# Altium schematic sheet STM32F103传感器板.SchDoc
size A3
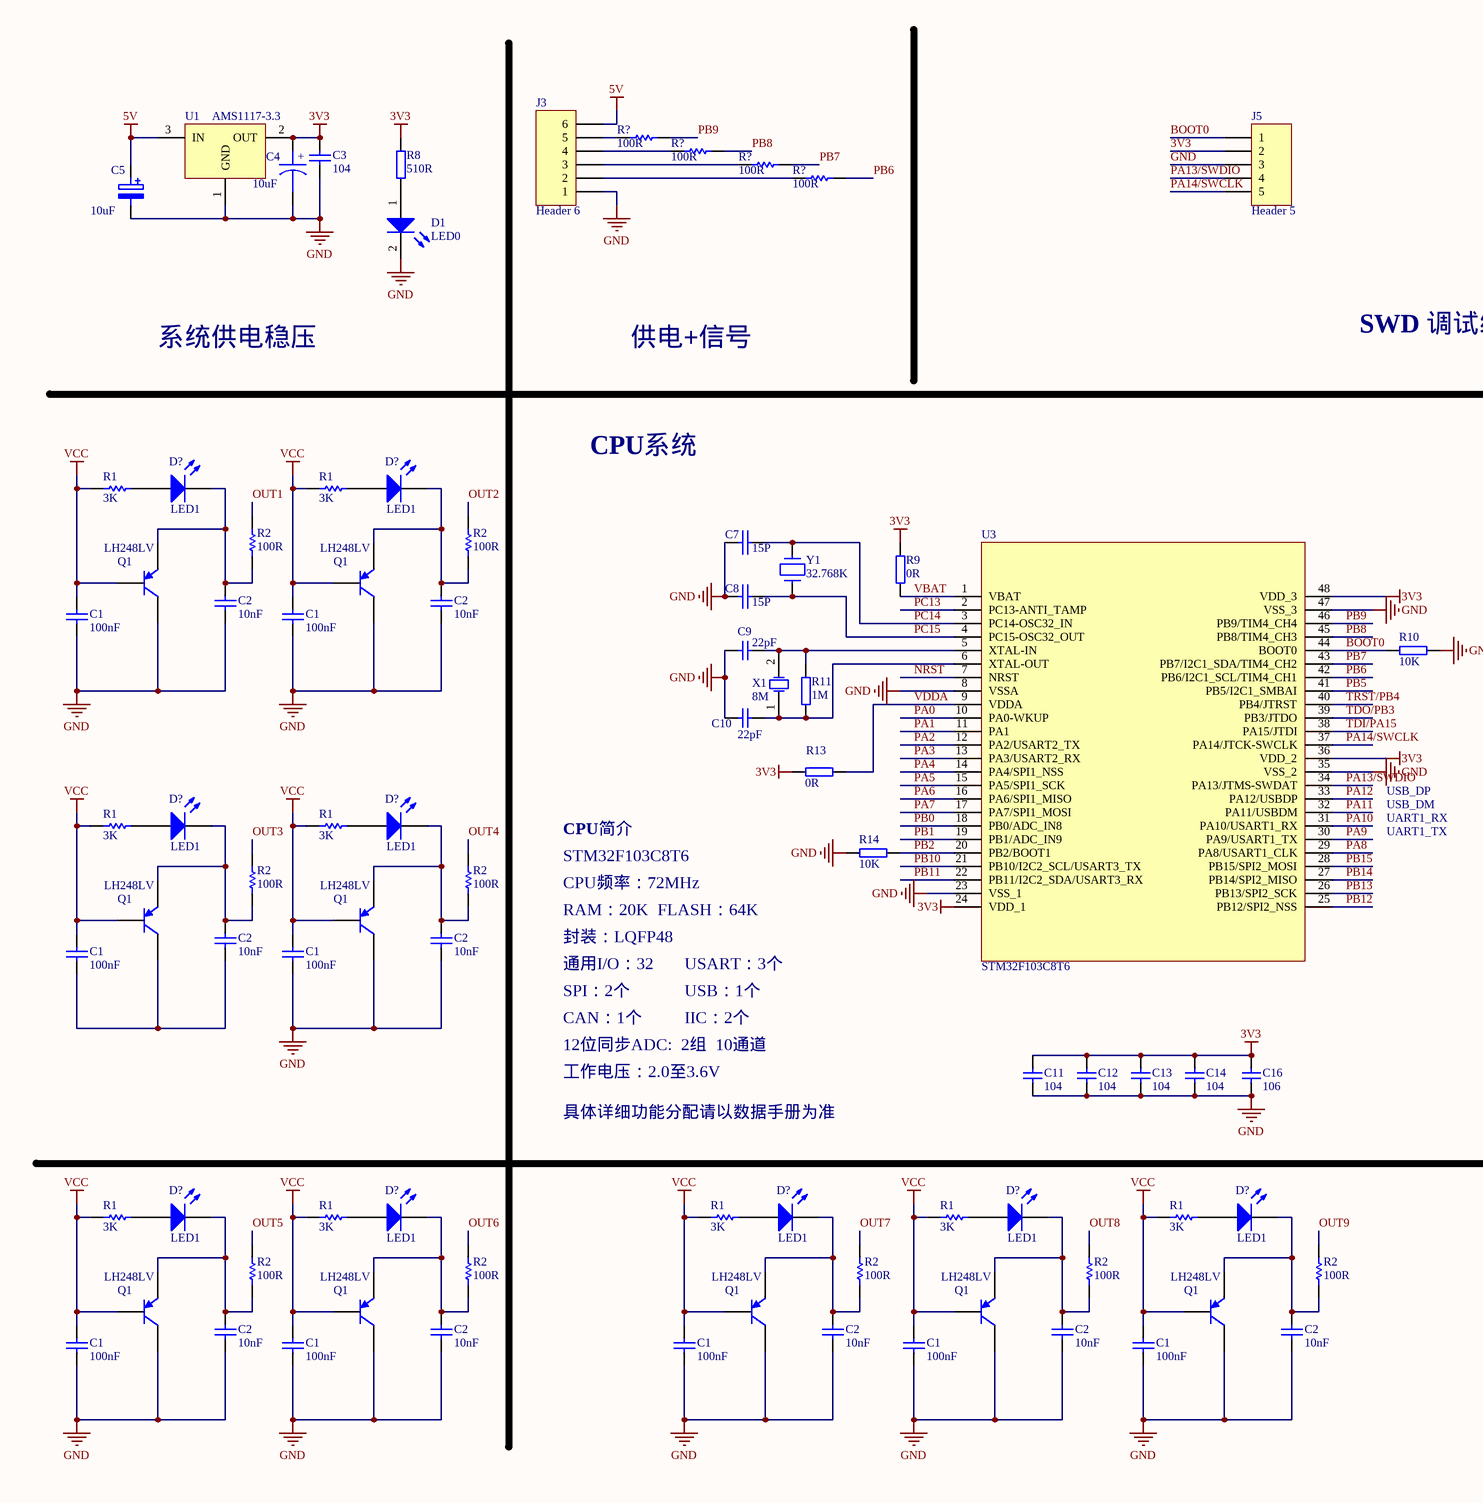
[diagram p0: STM32F103传感器板.SchDoc, left]
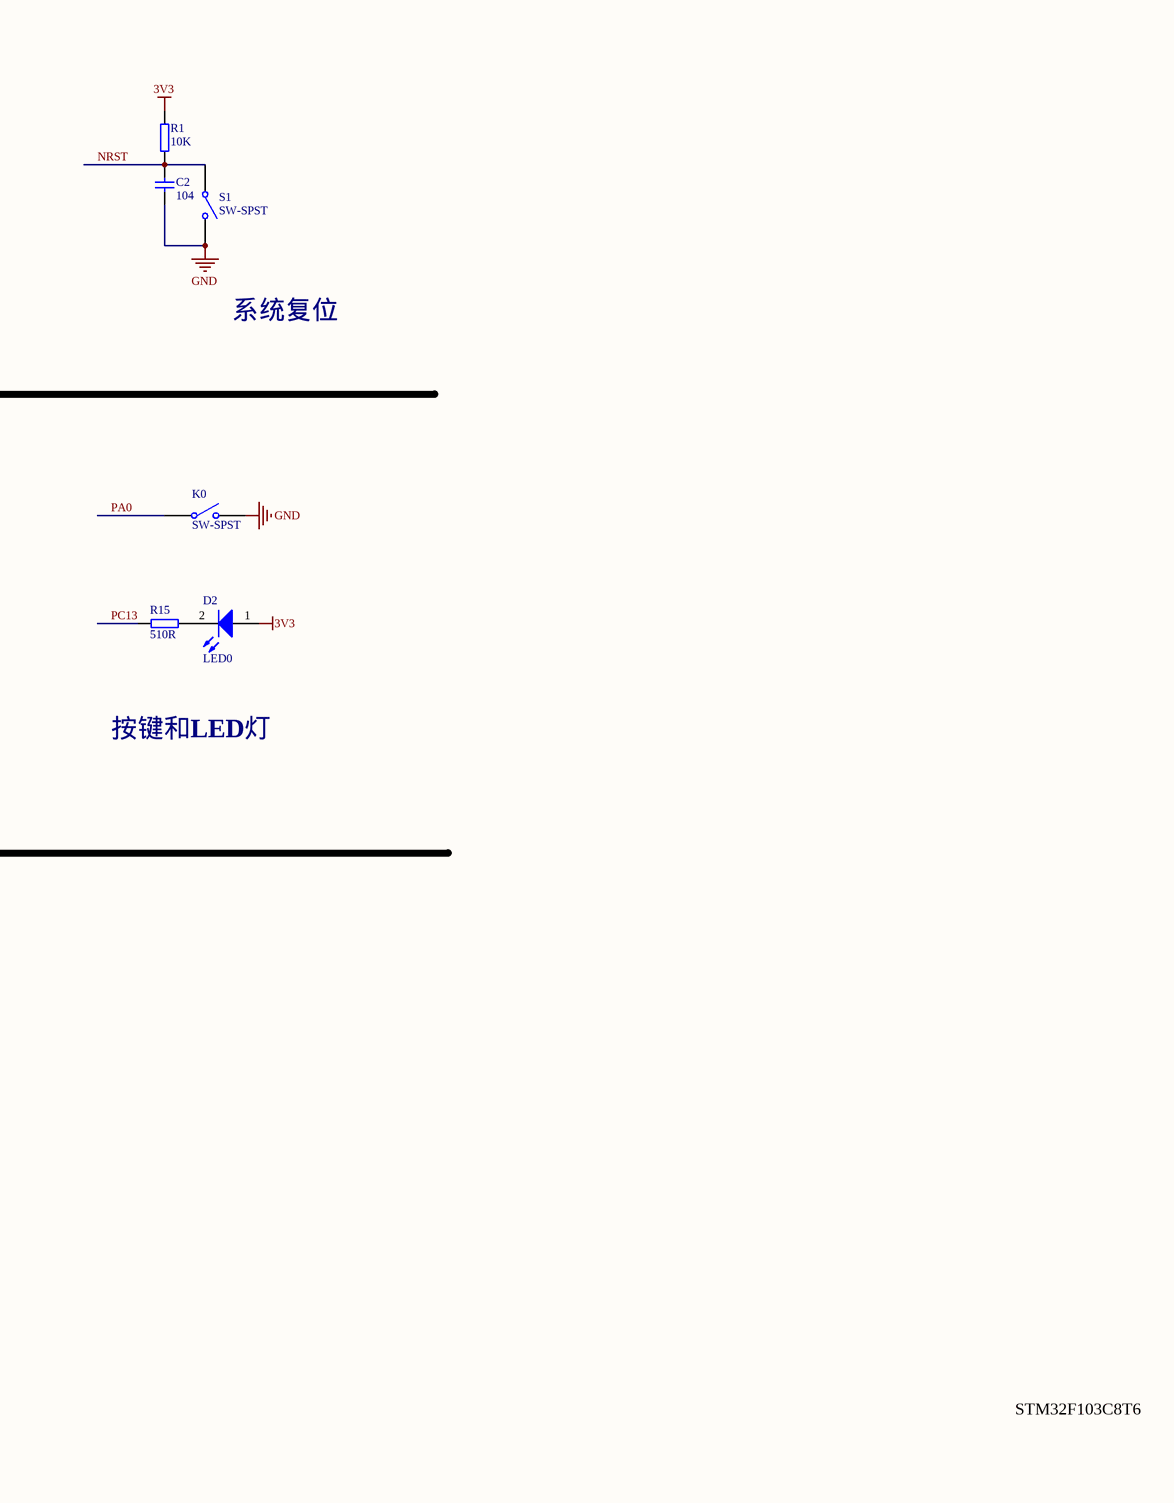
[diagram p1: STM32F103传感器板.SchDoc, right]

## Parts
(Parts that share a designator on the sheet are numbered #1, #2 ... from top to bottom, then left to right.)
C1#1  100nF  [RAD-0.3]
C1#2  100nF  [RAD-0.3]
C1#3  100nF  [RAD-0.3]
C1#4  100nF  [RAD-0.3]
C1#5  100nF  [RAD-0.3]
C1#6  100nF  [RAD-0.3]
C1#7  100nF  [RAD-0.3]
C1#8  100nF  [RAD-0.3]
C1#9  100nF  [RAD-0.3]
C2#1  104  [RC0603]
C2#2  10nF  [RAD-0.3]
C2#3  10nF  [RAD-0.3]
C2#4  10nF  [RAD-0.3]
C2#5  10nF  [RAD-0.3]
C2#6  10nF  [RAD-0.3]
C2#7  10nF  [RAD-0.3]
C2#8  10nF  [RAD-0.3]
C2#9  10nF  [RAD-0.3]
C2#10  10nF  [RAD-0.3]
C3  104  [RC0603]
C4  10uF  [RC0805]
C5  10uF  [RC0805]
C7  15P  [RC0603]
C8  15P  [RC0603]
C9  22pF  [RC0603]
C10  22pF  [RC0603]
C11  104  [RC0603]
C12  104  [RC0603]
C13  104  [RC0603]
C14  104  [RC0603]
C16  106  [RC0805]
D1  LED0  [LED0805]
D2  LED0  [LED0805]
D?#1  LED1  [LED-1]
D?#2  LED1  [LED-1]
D?#3  LED1  [LED-1]
D?#4  LED1  [LED-1]
D?#5  LED1  [LED-1]
D?#6  LED1  [LED-1]
D?#7  LED1  [LED-1]
D?#8  LED1  [LED-1]
D?#9  LED1  [LED-1]
J3  Header 6  [HDR1X6]
J5  Header 5  [HDR1X5]
K0  SW-SPST  [SMT-KEY]
Q1#1  LH248LV  [TO-92A]
Q1#2  LH248LV  [TO-92A]
Q1#3  LH248LV  [TO-92A]
Q1#4  LH248LV  [TO-92A]
Q1#5  LH248LV  [TO-92A]
Q1#6  LH248LV  [TO-92A]
Q1#7  LH248LV  [TO-92A]
Q1#8  LH248LV  [TO-92A]
Q1#9  LH248LV  [TO-92A]
R1#1  10K  [RC0603]
R1#2  3K  [AXIAL-0.3]
R1#3  3K  [AXIAL-0.3]
R1#4  3K  [AXIAL-0.3]
R1#5  3K  [AXIAL-0.3]
R1#6  3K  [AXIAL-0.3]
R1#7  3K  [AXIAL-0.3]
R1#8  3K  [AXIAL-0.3]
R1#9  3K  [AXIAL-0.3]
R1#10  3K  [AXIAL-0.3]
R2#1  100R  [AXIAL-0.3]
R2#2  100R  [AXIAL-0.3]
R2#3  100R  [AXIAL-0.3]
R2#4  100R  [AXIAL-0.3]
R2#5  100R  [AXIAL-0.3]
R2#6  100R  [AXIAL-0.3]
R2#7  100R  [AXIAL-0.3]
R2#8  100R  [AXIAL-0.3]
R2#9  100R  [AXIAL-0.3]
R8  510R  [RC0603]
R9  0R  [RC0603]
R10  10K  [RC0603]
R11  1M  [RC0603]
R13  0R  [RC0603]
R14  10K  [RC0603]
R15  510R  [RC0603]
R?#1  100R  [AXIAL-0.3]
R?#2  100R  [AXIAL-0.3]
R?#3  100R  [AXIAL-0.3]
R?#4  100R  [AXIAL-0.3]
S1  SW-SPST  [SMT-KEY]
U1  AMS1117-3.3  [SOT223]
U3  STM32F103C8T6  [LQFP48]
X1  8M  [SMD49S]
Y1  32.768K  [JZ32768]

## Nets
3V3: C3.1 C4.1 C11.1 C12.1 C13.1 C14.1 C16.1 D2.1(A) J5.2 R1#1.2 R8.2 R9.2 R13.2 U1.2(OUT) U3.24(VDD_1) U3.36(VDD_2) U3.48(VDD_3)
5V: C5.1 J3.6 U1.3(IN)
GND: C1#1.1 C1#2.1 C1#4.1 C1#5.1 C1#6.1 C1#7.1 C1#8.1 C1#9.1 C2#1.2 C2#2.1 C2#3.1 C2#5.1 C2#6.1 C2#7.1 C2#8.1 C2#9.1 C2#10.1 C3.2 C4.2 C5.2 C7.1 C8.1 C9.2 C10.2 C11.2 C12.2 C13.2 C14.2 C16.2 D1.2(K) J3.1 J5.3 K0.2(NO) Q1#1.3(C) Q1#2.3(C) Q1#4.3(C) Q1#5.3(C) Q1#6.3(C) Q1#7.3(C) Q1#8.3(C) Q1#9.3(C) R10.1 R14.2 S1.2(NO) U1.1(GND) U3.8(VSSA) U3.23(VSS_1) U3.35(VSS_2) U3.47(VSS_3)
VCC: C1#1.2 C1#2.2 C1#3.2 C1#4.2 C1#5.2 C1#6.2 C1#7.2 C1#8.2 C1#9.2 Q1#1.2(B) Q1#2.2(B) Q1#3.2(B) Q1#4.2(B) Q1#5.2(B) Q1#6.2(B) Q1#7.2(B) Q1#8.2(B) Q1#9.2(B) R1#2.1 R1#3.1 R1#4.1 R1#5.1 R1#6.1 R1#7.1 R1#8.1 R1#9.1 R1#10.1
BOOT0: J5.1 R10.2 U3.44(BOOT0)
NRST: C2#1.1 R1#1.1 S1.1(COMMON) U3.7(NRST)
OUT1: R2#1.2
OUT2: R2#2.2
OUT3: R2#3.2
OUT4: R2#4.2
OUT5: R2#5.2
OUT6: R2#6.2
OUT7: R2#7.2
OUT8: R2#8.2
OUT9: R2#9.2
PA0: K0.1(COMMON) U3.10(PA0-WKUP)
PA1: U3.11(PA1)
PA2: U3.12(PA2/USART2_TX)
PA3: U3.13(PA3/USART2_RX)
PA4: U3.14(PA4/SPI1_NSS)
PA5: U3.15(PA5/SPI1_SCK)
PA6: U3.16(PA6/SPI1_MISO)
PA7: U3.17(PA7/SPI1_MOSI)
PA8: U3.29(PA8/USART1_CLK)
PA9: U3.30(PA9/USART1_TX)
PA10: U3.31(PA10/USART1_RX)
PA11: U3.32(PA11/USBDM)
PA12: U3.33(PA12/USBDP)
PA13/SWDIO: J5.4 U3.34(PA13/JTMS-SWDAT)
PA14/SWCLK: J5.5 U3.37(PA14/JTCK-SWCLK)
PB0: U3.18(PB0/ADC_IN8)
PB1: U3.19(PB1/ADC_IN9)
PB2: R14.1 U3.20(PB2/BOOT1)
PB5: U3.41(PB5/I2C1_SMBAI)
PB6: R?#4.2 U3.42(PB6/I2C1_SCL/TIM4_CH1)
PB7: R?#3.2 U3.43(PB7/I2C1_SDA/TIM4_CH2)
PB8: R?#1.2 U3.45(PB8/TIM4_CH3)
PB9: R?#2.1 U3.46(PB9/TIM4_CH4)
PB10: U3.21(PB10/I2C2_SCL/USART3_TX)
PB11: U3.22(PB11/I2C2_SDA/USART3_RX)
PB12: U3.25(PB12/SPI2_NSS)
PB13: U3.26(PB13/SPI2_SCK)
PB14: U3.27(PB14/SPI2_MISO)
PB15: U3.28(PB15/SPI2_MOSI)
PC13: R15.1 U3.2(PC13-ANTI_TAMP)
PC14: C7.2 U3.3(PC14-OSC32_IN) Y1.2
PC15: C8.2 U3.4(PC15-OSC32_OUT) Y1.1
TDI/PA15: U3.38(PA15/JTDI)
TDO/PB3: U3.39(PB3/JTDO)
TRST/PB4: U3.40(PB4/JTRST)
VBAT: R9.1 U3.1(VBAT)
VDDA: R13.1 U3.9(VDDA)
NetC1#3_1: C1#3.1 C2#4.1 Q1#3.3(C)
NetC2#2_2: C2#2.2 D?#1.2(K) Q1#1.1(E) R2#1.1
NetC2#3_2: C2#3.2 D?#2.2(K) Q1#2.1(E) R2#2.1
NetC2#4_2: C2#4.2 D?#3.2(K) Q1#3.1(E) R2#3.1
NetC2#5_2: C2#5.2 D?#4.2(K) Q1#4.1(E) R2#4.1
NetC2#6_2: C2#6.2 D?#5.2(K) Q1#5.1(E) R2#5.1
NetC2#7_2: C2#7.2 D?#6.2(K) Q1#6.1(E) R2#6.1
NetC2#8_2: C2#8.2 D?#7.2(K) Q1#7.1(E) R2#7.1
NetC2#9_2: C2#9.2 D?#8.2(K) Q1#8.1(E) R2#8.1
NetC2#10_2: C2#10.2 D?#9.2(K) Q1#9.1(E) R2#9.1
NetC9_1: C9.1 R11.2 U3.5(XTAL-IN) X1.2
NetC10_1: C10.1 R11.1 U3.6(XTAL-OUT) X1.1
NetD1_1: D1.1(A) R8.1
NetD2_2: D2.2(K) R15.2
NetD?#1_1: D?#1.1(A) R1#2.2
NetD?#2_1: D?#2.1(A) R1#3.2
NetD?#3_1: D?#3.1(A) R1#4.2
NetD?#4_1: D?#4.1(A) R1#5.2
NetD?#5_1: D?#5.1(A) R1#6.2
NetD?#6_1: D?#6.1(A) R1#7.2
NetD?#7_1: D?#7.1(A) R1#8.2
NetD?#8_1: D?#8.1(A) R1#9.2
NetD?#9_1: D?#9.1(A) R1#10.2
NetJ3_2: J3.2 R?#4.1
NetJ3_3: J3.3 R?#3.1
NetJ3_4: J3.4 R?#1.1
NetJ3_5: J3.5 R?#2.2

## Notes on the sheet
- 系统供电稳压
- 供电+信号
- SWD 调试编程接口
- 系统复位
- CPU系统
- 按键和LED灯
- CPU简介
- UART1_TX
- UART1_RX
- USB_DM
- USB_DP
- STM32F103C8T6
- RAM：20K
- CPU频率：72MHz
- FLASH：64K
- 封装：LQFP48
- 通用I/O：32
- USART：3个
- CAN：1个
- 12位同步ADC:  2组  10通道
- SPI：2个
- USB：1个
- IIC：2个
- 工作电压：2.0至3.6V
- 具体详细功能分配请以数据手册为准
- (in symbol CAPACITOR POL) +

## Library data of the parts
C1#1-C1#9 C2#2-C2#10 C3 = Cap: Capacitor; Published: 8-Jun-2000; LatestRevisionDate: 17-Jul-2002; LatestRevisionNote: Re-released for DXP Platform.; PackageReference: RAD-0.3; Publisher: Altium Limited
  C1#1-C1#9 C2#2-C2#10: PackageDescription: Radial Cap, Thru-Hole; 2 Leads; 0.3 in Pin Spacing
C2#1 C11-C14 C16 = CAP1: Capacitor; Tolerate: 50V; Value: 100nF; TOL: 10%; ERP: 0103020075; PCB_Layout: Top Layer SMC; Revision: 2012-3-28; Publisher: ZL_A0OFFICE
C4 = CAPACITOR POL: Capacitor
C5 = ELECTRO2
C7 C8 = CAP
C9 C10 = CAP1: Capacitor; Tolerate: 50V; Value: 20pF; TOL: 2%; ERP: 0103020090; PCB_Layout: Top Layer SMC; Revision: 2012-3-28; Publisher: ZL_A0OFFICE
D1 D2 = LED0: Typical INFRARED GaAs LED
D?#1-D?#9 = LED1: Typical RED GaAs LED; Published: 8-Jun-2000; LatestRevisionDate: 08-Jul-2005; LatestRevisionNote: Mech Layer 1 removed.; PackageReference: LED-1; Publisher: Altium Limited; PackageDescription: LED; 2 Leads
J3 = Header 6: Header, 6-Pin; LatestRevisionDate: 17-Jul-2002; LatestRevisionNote: Re-released for DXP Platform.; Publisher: Altium Limited
J5 = Header 5: Header, 5-Pin; LatestRevisionDate: 17-Jul-2002; LatestRevisionNote: Re-released for DXP Platform.; Publisher: Altium Limited
K0 S1 = SW-SPST: Single-Pole, Single-Throw Switch
Q1#1-Q1#9 = 2N3906: PNP General Purpose Amplifier; Published: 8-Jun-2000; LatestRevisionDate: 15-Jan-2003; LatestRevisionNote: PCB Footprint 'BCY-W3/D4.7' replaced; DatasheetVersion: 1997; PackageVersion: Sep-1998; PackageReference: TO-92A; Publisher: Altium Limited; PackageDescription: TO, Flat Index; 3 In-Line, Axial Leads; Body Dia. 4.5mm; Leads 0.51 x 0.48 mm (max); ComponentLink1Description: Manufacturer Link; ComponentLink1URL: http://www.fairchildsemi.com/; ComponentLink2Description: Datasheet; ComponentLink2URL: http://www.fairchildsemi.com/ds/2N%2F2N3906.pdf
R1#1 R8-R11 R13-R15 = R
R1#2-R1#10 R2#1-R2#9 R?#1-R?#4 = Res1: Resistor; Published: 8-Jun-2000; LatestRevisionDate: 17-Jul-2002; LatestRevisionNote: Re-released for DXP Platform.; PackageReference: AXIAL-0.3; Publisher: Altium Limited; PackageDescription: Axial Device, Thru-Hole; 2 Leads; 0.3 in Pin Spacing
U1 = LT1085CM-3.3
X1 = XTAL_SMD: Crystal Oscillator; ERP: 0103040021; Value: 8MHz; TOL: ±20ppm; Tolerate: ROSON -20_+70 20pf; PCB_Layout: Top Layer SMC; Publisher: ZL_A0OFFICE; Revision: 2012-3-28
Y1 = CRYSTAL: 晶振